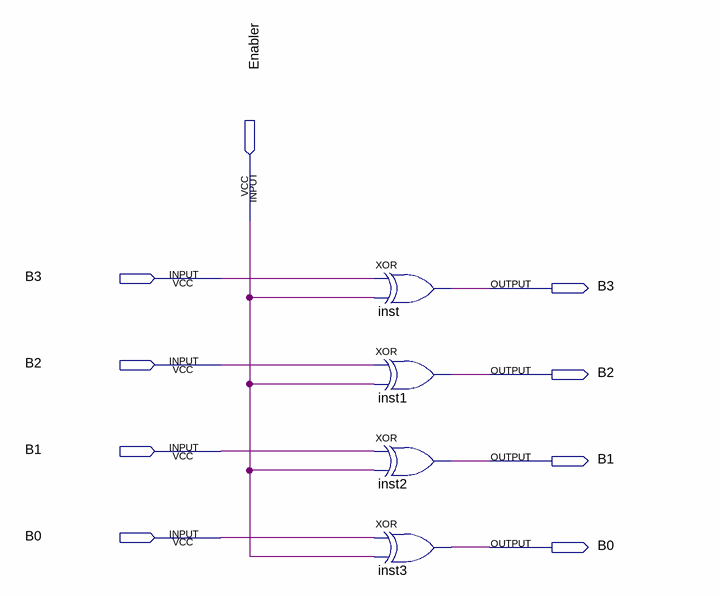
[diagram p0: schematic sheet]
// Quartus schematic 4BitNot.bdf as structural Verilog: 4 symbols, 9 pins
module \4BitNot  (
  input  Enabler,
  inout  B3,
  inout  B2,
  inout  B1,
  inout  B0
);

  xor inst (B3, B3, Enabler);
  xor inst1 (B2, B2, Enabler);
  xor inst2 (B1, B1, Enabler);
  xor inst3 (B0, B0, Enabler);
endmodule
